# EAGLE schematic Project_Schematic (EAGLE 9.6.2)
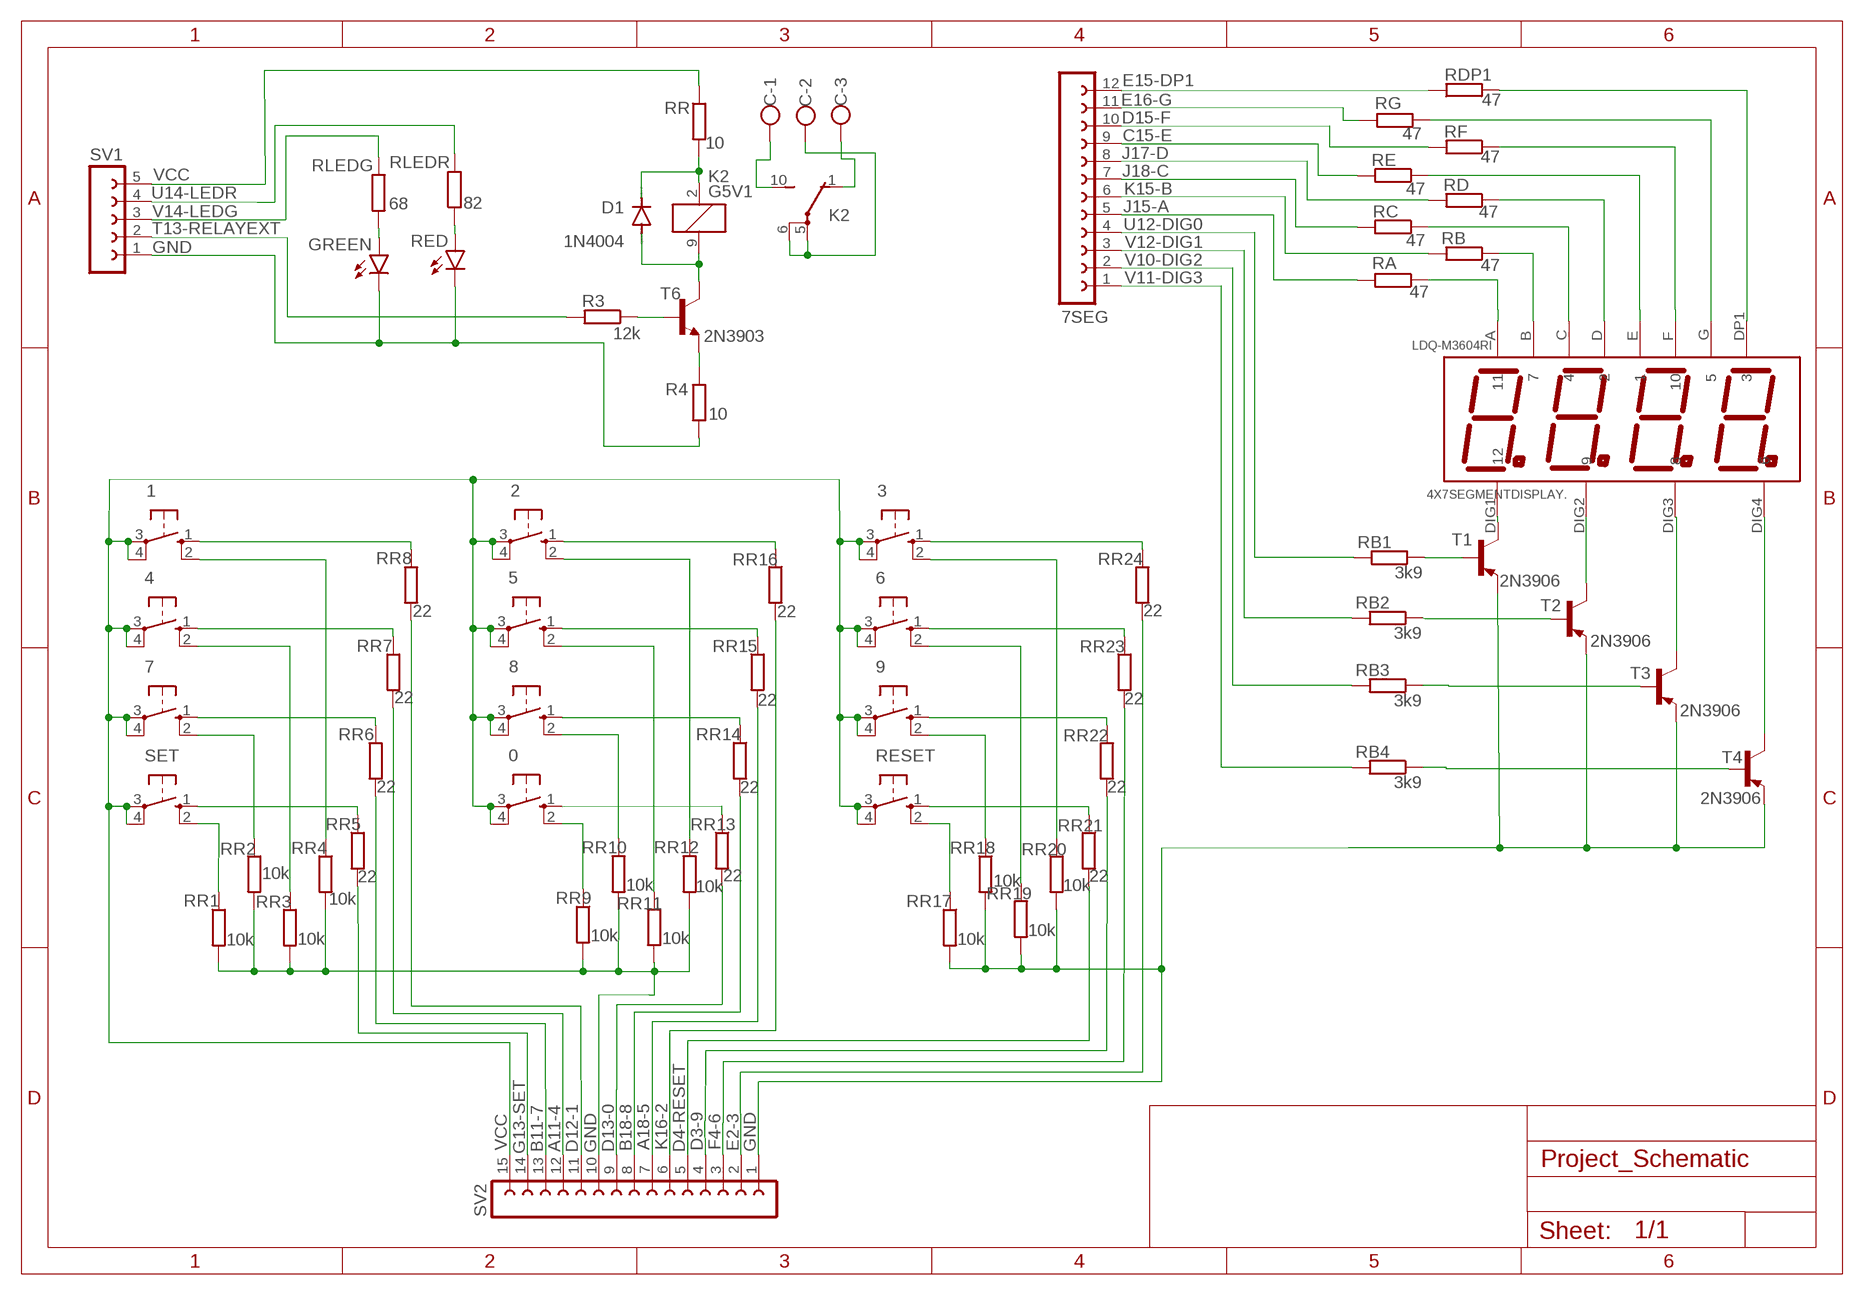
[diagram p0: schematic, sheet 1]

## Parts
0  10-XX  [B3F-10XX]
1  10-XX  [B3F-10XX]
2  10-XX  [B3F-10XX]
3  10-XX  [B3F-10XX]
4  10-XX  [B3F-10XX]
5  10-XX  [B3F-10XX]
6  10-XX  [B3F-10XX]
7  10-XX  [B3F-10XX]
7SEG  FE12-1  [FE12]
8  10-XX  [B3F-10XX]
9  10-XX  [B3F-10XX]
C  W237-103  [W237-103]
D1  1N4004  [DO41-10]
GREEN  LED5MM  [LED5MM]
K2  G5V1  [G5V1]
LDQ-M3604RI  4X7SEGMENTDISPLAY.  [4X7SCHEM]
R3  12k  R-EU_0207/10  [0207/10]
R4  10  R-EU_0207/10  [0207/10]
RA  47  R-EU_0207/10  [0207/10]
RB  47  R-EU_0207/10  [0207/10]
RB1  3k9  R-EU_0207/10  [0207/10]
RB2  3k9  R-EU_0207/10  [0207/10]
RB3  3k9  R-EU_0207/10  [0207/10]
RB4  3k9  R-EU_0207/10  [0207/10]
RC  47  R-EU_0207/10  [0207/10]
RD  47  R-EU_0207/10  [0207/10]
RDP1  47  R-EU_0207/10  [0207/10]
RE  47  R-EU_0207/10  [0207/10]
RED  LED5MM  [LED5MM]
RESET  10-XX  [B3F-10XX]
RF  47  R-EU_0207/10  [0207/10]
RG  47  R-EU_0207/10  [0207/10]
RLEDG  68  R-EU_0207/10  [0207/10]
RLEDR  82  R-EU_0207/10  [0207/10]
RR  10  R-EU_0207/10  [0207/10]
RR1  10k  R-EU_0207/10  [0207/10]
RR2  10k  R-EU_0207/10  [0207/10]
RR3  10k  R-EU_0207/10  [0207/10]
RR4  10k  R-EU_0207/10  [0207/10]
RR5  22  R-EU_0207/10  [0207/10]
RR6  22  R-EU_0207/10  [0207/10]
RR7  22  R-EU_0207/10  [0207/10]
RR8  22  R-EU_0207/10  [0207/10]
RR9  10k  R-EU_0207/10  [0207/10]
RR10  10k  R-EU_0207/10  [0207/10]
RR11  10k  R-EU_0207/10  [0207/10]
RR12  10k  R-EU_0207/10  [0207/10]
RR13  22  R-EU_0207/10  [0207/10]
RR14  22  R-EU_0207/10  [0207/10]
RR15  22  R-EU_0207/10  [0207/10]
RR16  22  R-EU_0207/10  [0207/10]
RR17  10k  R-EU_0207/10  [0207/10]
RR18  10k  R-EU_0207/10  [0207/10]
RR19  10k  R-EU_0207/10  [0207/10]
RR20  10k  R-EU_0207/10  [0207/10]
RR21  22  R-EU_0207/10  [0207/10]
RR22  22  R-EU_0207/10  [0207/10]
RR23  22  R-EU_0207/10  [0207/10]
RR24  22  R-EU_0207/10  [0207/10]
SET  10-XX  [B3F-10XX]
SV1  FE05-1  [FE05-1]
SV2  FE15-1  [FE15]
T1  2N3906  2N3906-PNP-TO92-EBC  [TO92-EBC]
T2  2N3906  2N3906-PNP-TO92-EBC  [TO92-EBC]
T3  2N3906  2N3906-PNP-TO92-EBC  [TO92-EBC]
T4  2N3906  2N3906-PNP-TO92-EBC  [TO92-EBC]
T6  2N3903  2N3903-NPN-TO92-EBC  [TO92-EBC]

## Nets
A11-4: RR7.2 SV2.12
A18-5: RR15.2 SV2.7
B11-7: RR6.2 SV2.13
B18-8: RR14.2 SV2.8
C15-E: 7SEG.9 RE.2
D3-9: RR22.2 SV2.4
D4-RESET: RR21.2 SV2.5
D12-1: RR8.2 SV2.11
D13-0: RR13.2 SV2.9
D15-F: 7SEG.10 RF.2
E2-3: RR24.2 SV2.2
E15-DP1: 7SEG.12 RDP1.1
E16-G: 7SEG.11 RG.2
F4-6: RR23.2 SV2.3
G13-SET: RR5.2 SV2.14
GND: GREEN.K(C) R4.2 RED.K(C) RR1.2 RR2.2 RR3.2 RR4.2 RR9.2 RR10.2 RR11.2 RR12.2 RR17.2 RR18.2 RR19.2 RR20.2 SV1.1 SV2.1 SV2.10 T1.E T2.E T3.E T4.E
J15-A: 7SEG.5 RA.2
J17-D: 7SEG.8 RD.2
J18-C: 7SEG.7 RC.2
K15-B: 7SEG.6 RB.2
K16-2: RR16.2 SV2.6
N$1: RB1.1 T1.B
N$2: LDQ-M3604RI.DIG2 T2.C
N$3: LDQ-M3604RI.DIG1 T1.C
N$4: LDQ-M3604RI.DIG3 T3.C
N$5: LDQ-M3604RI.DIG4 T4.C
N$6: RB2.1 T2.B
N$7: RB3.1 T3.B
N$8: RB4.1 T4.B
N$11: LDQ-M3604RI.A RA.1
N$12: LDQ-M3604RI.B RB.1
N$13: LDQ-M3604RI.C RC.1
N$14: LDQ-M3604RI.D RD.1
N$15: LDQ-M3604RI.E RE.1
N$16: LDQ-M3604RI.F RF.1
N$17: LDQ-M3604RI.G RG.1
N$18: LDQ-M3604RI.DP1 RDP1.2
N$20: RR5.1 SET.1(S)
N$21: 7.1(S) RR6.1
N$23: 1.1(S) RR8.1
N$24: D1.C K2.2 RR.2
N$25: 0.1(S) RR13.1
N$26: 8.1(S) RR14.1
N$27: 2.1(S) RR16.1
N$28: 8.2(S1) RR10.1
N$29: 5.2(S1) RR11.1
N$30: R3.1 T6.B
N$31: R4.1 T6.E
N$32: 2.2(S1) RR12.1
N$33: 0.2(S1) RR9.1
N$34: 5.1(S) RR15.1
N$37: C.1 K2.10(2:S)
N$38: C.2 K2.5(2:P) K2.6(2:P)
N$39: GREEN.A RLEDG.2
N$40: RED.A RLEDR.1
N$41: C.3 K2.1(2:O)
N$42: RR1.1 SET.2(S1)
N$43: 7.2(S1) RR2.1
N$44: 4.2(S1) RR3.1
N$45: 1.2(S1) RR4.1
N$46: 4.1(S) RR7.1
N$48: D1.A K2.9 T6.C
N$54: 0.3(P) 0.4(P1) 2.3(P) 2.4(P1) 5.3(P) 5.4(P1) 8.3(P) 8.4(P1)
N$55: RESET.1(S) RR21.1
N$56: 9.1(S) RR22.1
N$57: 3.1(S) RR24.1
N$58: 9.2(S1) RR18.1
N$59: 6.2(S1) RR19.1
N$60: 3.2(S1) RR20.1
N$61: RESET.2(S1) RR17.1
N$62: 6.1(S) RR23.1
T13-RELAYEXT: R3.2 SV1.2
U12-DIG0: 7SEG.4 RB1.2
U14-LEDR: RLEDR.2 SV1.4
V10-DIG2: 7SEG.2 RB3.2
V11-DIG3: 7SEG.1 RB4.2
V12-DIG1: 7SEG.3 RB2.2
V14-LEDG: RLEDG.1 SV1.3
VCC: 1.3(P) 1.4(P1) 3.3(P) 3.4(P1) 4.3(P) 4.4(P1) 6.3(P) 6.4(P1) 7.3(P) 7.4(P1) 9.3(P) 9.4(P1) RESET.3(P) RESET.4(P1) RR.1 SET.3(P) SET.4(P1) SV1.5 SV2.15

## Library data of the parts
0 1-9 RESET SET = switch-omron:10-XX: OMRON SWITCH; MPN: B3F-1000; OC_FARNELL: 176432; OC_NEWARK: 36M3542
7SEG = con-lsta:FE12-1: FEMALE HEADER; OC_FARNELL: unknown; OC_NEWARK: unknown
C = con-wago-500:W237-103: WAGO SCREW CLAMP; MPN: 237-103; OC_FARNELL: unknown; OC_NEWARK: 18M7116
D1 = diode:1N4004: DIODE general purpose rectifier, 1 A
GREEN RED = led:LED: LED OSRAM: - CHIPLED LG R971, LG N971, LY N971, LG Q971, LY Q971, LO R971, LY R971 LH N974, LH R974 LS Q976, LO Q976, LY Q976 LO Q996 - Hyper CHIPLED LW Q18S LB Q993, LB Q99A, LB R99A - SideLED LS A670, LO A670, LY A670, LG A670, LP A670 LB A673, LV A673, LT A673, LW A673 LH A674 LY A675 LS A676, LA A676, LO A676, LY A676, LW A676 LS A679, LY A679, LG A679 - Hyper Micro SIDELED® LS Y876, LA Y876, LO Y876, LY Y876 LT Y87S - SmartLED LW L88C, LW L88S LB L89C, LB L89S, LG L890 LS L89K, LO L89K, LY L89K LS L896, LA L896, LO L896, LY L896 - TOPLED LS T670, LO T670, LY T670, LG T670, LP T670 LSG T670, LSP T670, LSY T670, LOP T670, LYG T670 LG T671, LOG T671, LSG T671 LB T673, LV T673, LT T673, LW T673 LH T674 LS T676, LA T676, LO T676, LY T676, LB T676, LH T676, LSB T676, LW T676 LB T67C, LV T67C, LT T67C, LS T67K, LO T67K, LY T67K, LW E67C LS E67B, LA E67B, LO E67B, LY E67B, LB E67C, LV E67C, LT E67C LW T67C LS T679, LY T679, LG T679 LS T770, LO T770, LY T770, LG T770, LP T770 LB T773, LV T773, LT T773, LW T773 LH T774 LS E675, LA E675, LY E675, LS T675 LS T776, LA T776, LO T776, LY T776, LB T776 LHGB T686 LT T68C, LB T68C - Hyper Mini TOPLED® LB M676 - Mini TOPLED Santana® LG M470 LS M47K, LO M47K, LY M47K Source: http://www.osram.convergy.de LUXEON: - LUMILED® LXK2-PW12-R00, LXK2-PW12-S00, LXK2-PW14-U00, LXK2-PW14-V00 LXK2-PM12-R00, LXK2-PM12-S00, LXK2-PM14-U00 LXK2-PE12-Q00, LXK2-PE12-R00, LXK2-PE12-S00, LXK2-PE14-T00, LXK2-PE14-U00 LXK2-PB12-K00, LXK2-PB12-L00, LXK2-PB12-M00, LXK2-PB14-N00, LXK2-PB14-P00, LXK2-PB14-Q00 LXK2-PR12-L00, LXK2-PR12-M00, LXK2-PR14-Q00, LXK2-PR14-R00 LXK2-PD12-Q00, LXK2-PD12-R00, LXK2-PD12-S00 LXK2-PH12-R00, LXK2-PH12-S00 LXK2-PL12-P00, LXK2-PL12-Q00, LXK2-PL12-R00 Source: www.luxeon.com KINGBRIGHT: KA-3528ASYC Source: www.kingbright.com
K2 = relay:G5V1: RELAY 1 x switch, 0.5 A/125 V AC, 1 A/24 V DC , Omron; MPN: G5V-1-DC24; OC_FARNELL: 9949593; OC_NEWARK: 36M6377
LDQ-M3604RI = 4x7seg dispaly LDQ-M3604RI:4X7SEGMENTDISPLAY
R3 R4 RA RB RB1-RB4 RC RD RDP1 RE RF RG RLEDG RLEDR RR RR1-RR24 = rcl:R-EU_: RESISTOR, European symbol; SPICEPREFIX: R
SV1 = con-lsta:FE05-1: FEMALE HEADER; OC_FARNELL: unknown; OC_NEWARK: unknown
SV2 = con-lsta:FE15-1: FEMALE HEADER; OC_FARNELL: unknown; OC_NEWARK: unknown
T1-T4 = transistor-neu-to92:*-PNP-: PNP Transistror
T6 = transistor-neu-to92:*-NPN-: NPN Transistror